# EAGLE design NewPulse (EAGLE 6.2)
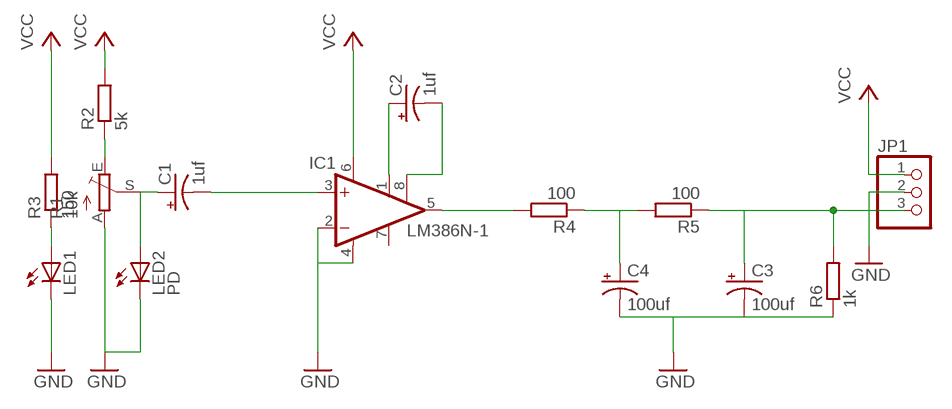
[diagram p0: schematic, sheet 1]

## Parts
C1  1uf  CPOL-USE2-5  [E2-5]
C2  1uf  CPOL-USE2-5  [E2-5]
C3  100uf  CPOL-USE2-5  [E2-5]
C4  100uf  CPOL-USE2-5  [E2-5]
IC1  LM386N-1  [DIL08]
JP1  PINHD-1X3/90  [1X03/90]
LED1  LED5MM  [LED5MM]
LED2  PD  LED5MM  [LED5MM]
R1  10k  TRIM_EU-CA6V  [CA6V]
R2  5k  R-EU_0207/10  [0207/10]
R3  150  R-EU_0207/10  [0207/10]
R4  100  R-EU_0207/10  [0207/10]
R5  100  R-EU_0207/10  [0207/10]
R6  1k  R-EU_0207/10  [0207/10]

## Nets
GND: C3.- C4.- IC1.2(-IN) IC1.4(GND) JP1.2 LED1.K(C) LED2.K(C) R1.A R6.1
N$1: LED1.A R3.1
N$2: R1.E R2.1
N$3: C1.+ LED2.A R1.S
N$4: C1.- IC1.3(+IN)
N$5: C2.+ IC1.1(GAIN)
N$6: C2.- IC1.8(GAIN)
N$7: IC1.5(OUT) R4.2
N$8: C4.+ R4.1 R5.2
N$9: C3.+ JP1.3 R5.1 R6.2
VCC: IC1.6(VS) JP1.1 R2.2 R3.2
Unconnected: IC1.7(BYPASS)

## Library data of the parts
C1-C4 = resistor:CPOL-US: POLARIZED CAPACITOR, American symbol
IC1 = linear:LM386?-*: Low Voltage Audio Power Amplifier Source: http://cache.national.com/ds/LM/LM386.pdf
JP1 = pinhead:PINHD-1X3: PIN HEADER
LED1 LED2 = adafruit:LED: LED OSRAM: - CHIPLED LG R971, LG N971, LY N971, LG Q971, LY Q971, LO R971, LY R971 LH N974, LH R974 LS Q976, LO Q976, LY Q976 LO Q996 - Hyper CHIPLED LW Q18S LB Q993, LB Q99A, LB R99A - SideLED LS A670, LO A670, LY A670, LG A670, LP A670 LB A673, LV A673, LT A673, LW A673 LH A674 LY A675 LS A676, LA A676, LO A676, LY A676, LW A676 LS A679, LY A679, LG A679 - Hyper Micro SIDELED® LS Y876, LA Y876, LO Y876, LY Y876 LT Y87S - SmartLED LW L88C, LW L88S LB L89C, LB L89S, LG L890 LS L89K, LO L89K, LY L89K LS L896, LA L896, LO L896, LY L896 - TOPLED LS T670, LO T670, LY T670, LG T670, LP T670 LSG T670, LSP T670, LSY T670, LOP T670, LYG T670 LG T671, LOG T671, LSG T671 LB T673, LV T673, LT T673, LW T673 LH T674 LS T676, LA T676, LO T676, LY T676, LB T676, LH T676, LSB T676, LW T676 LB T67C, LV T67C, LT T67C, LS T67K, LO T67K, LY T67K, LW E67C LS E67B, LA E67B, LO E67B, LY E67B, LB E67C, LV E67C, LT E67C LW T67C LS T679, LY T679, LG T679 LS T770, LO T770, LY T770, LG T770, LP T770 LB T773, LV T773, LT T773, LW T773 LH T774 LS E675, LA E675, LY E675, LS T675 LS T776, LA T776, LO T776, LY T776, LB T776 LHGB T686 LT T68C, LB T68C - Hyper Mini TOPLED® LB M676 - Mini TOPLED Santana® LG M470 LS M47K, LO M47K, LY M47K Source: http://www.osram.convergy.de/
R1 = pot:TRIM_EU-: POTENTIOMETER
R2-R6 = resistor:R-EU_: RESISTOR, European symbol

## Board
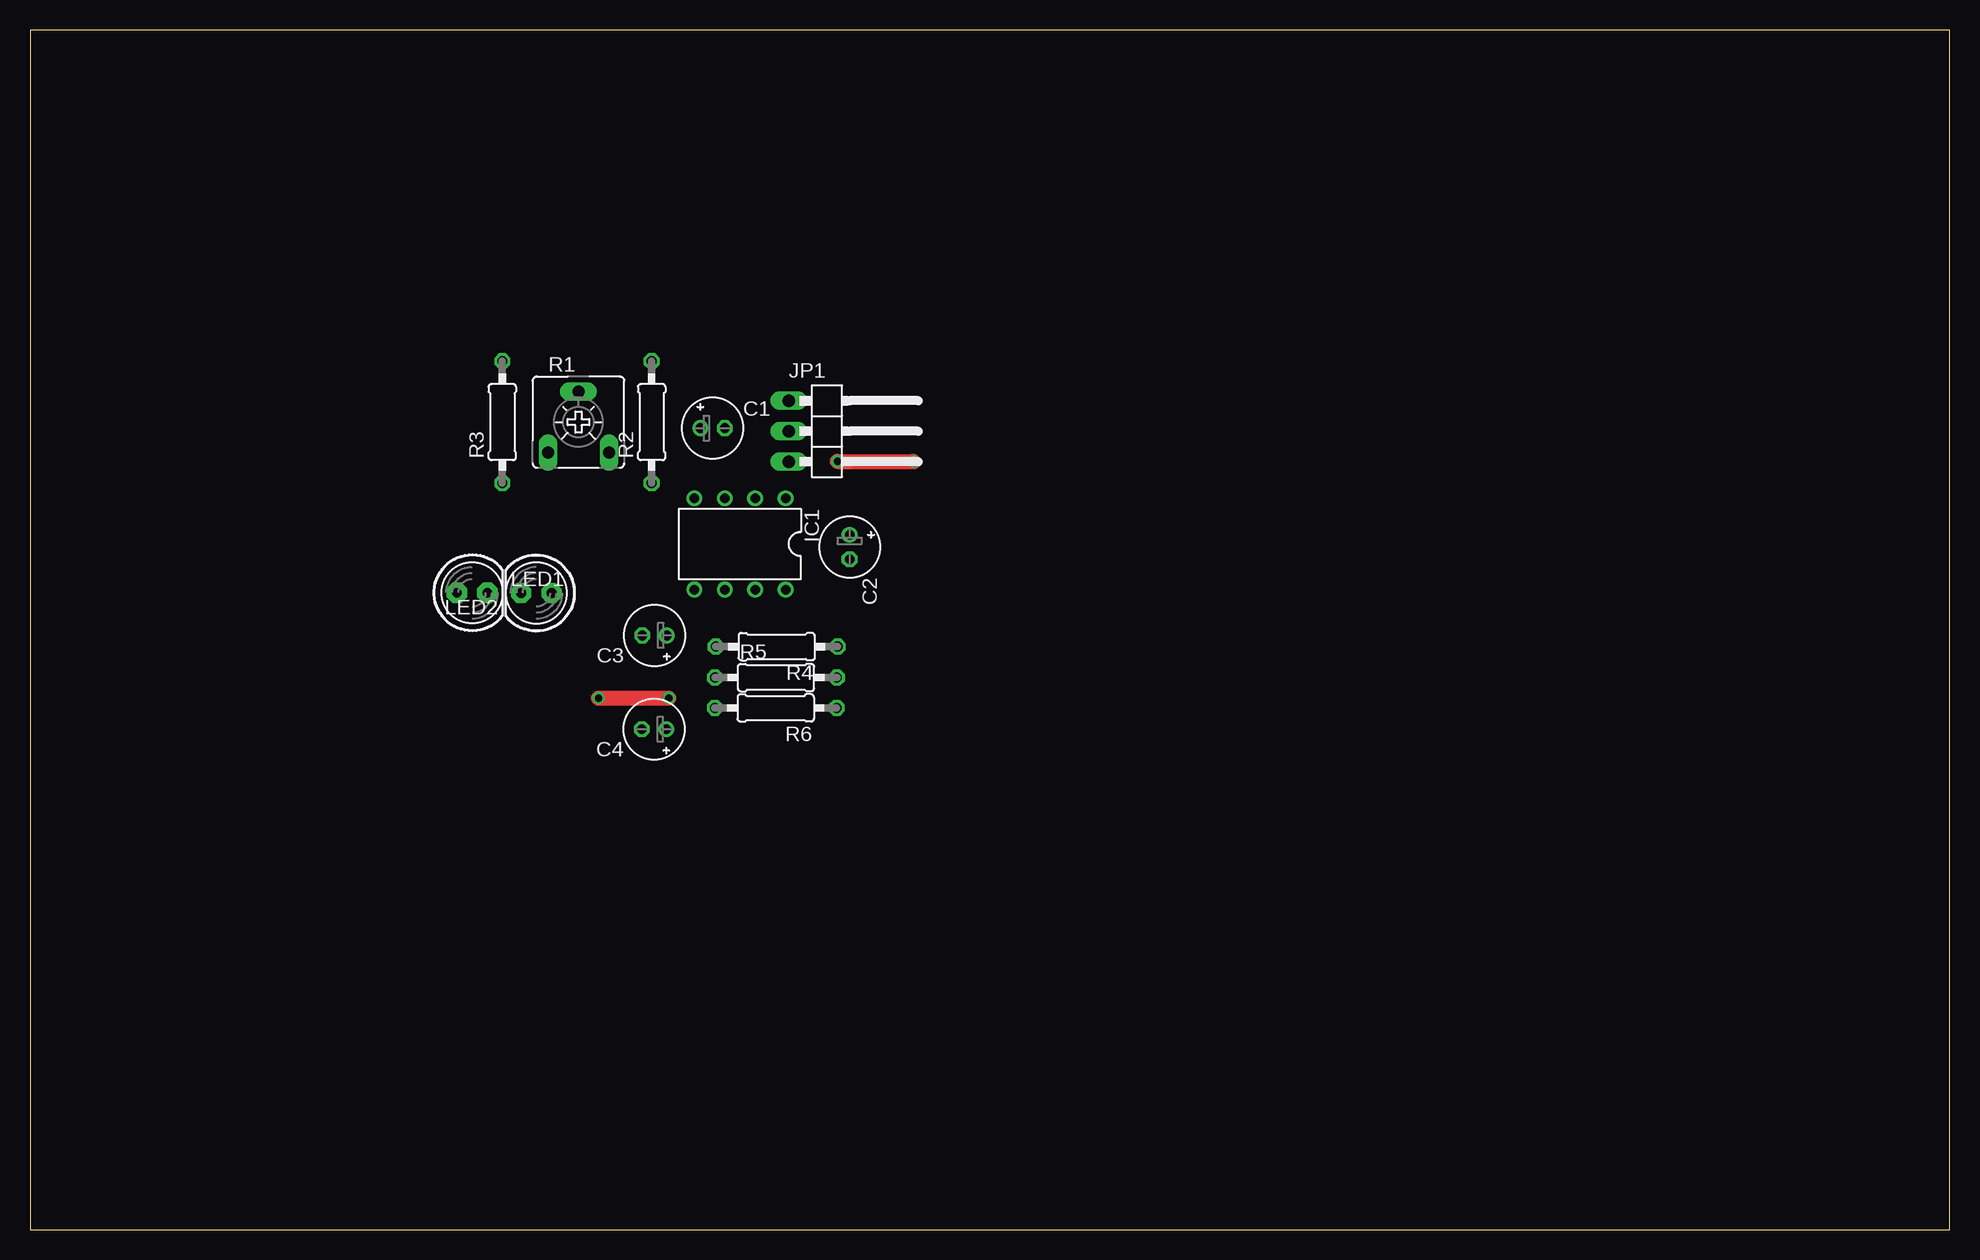
[diagram p1: board, top side]
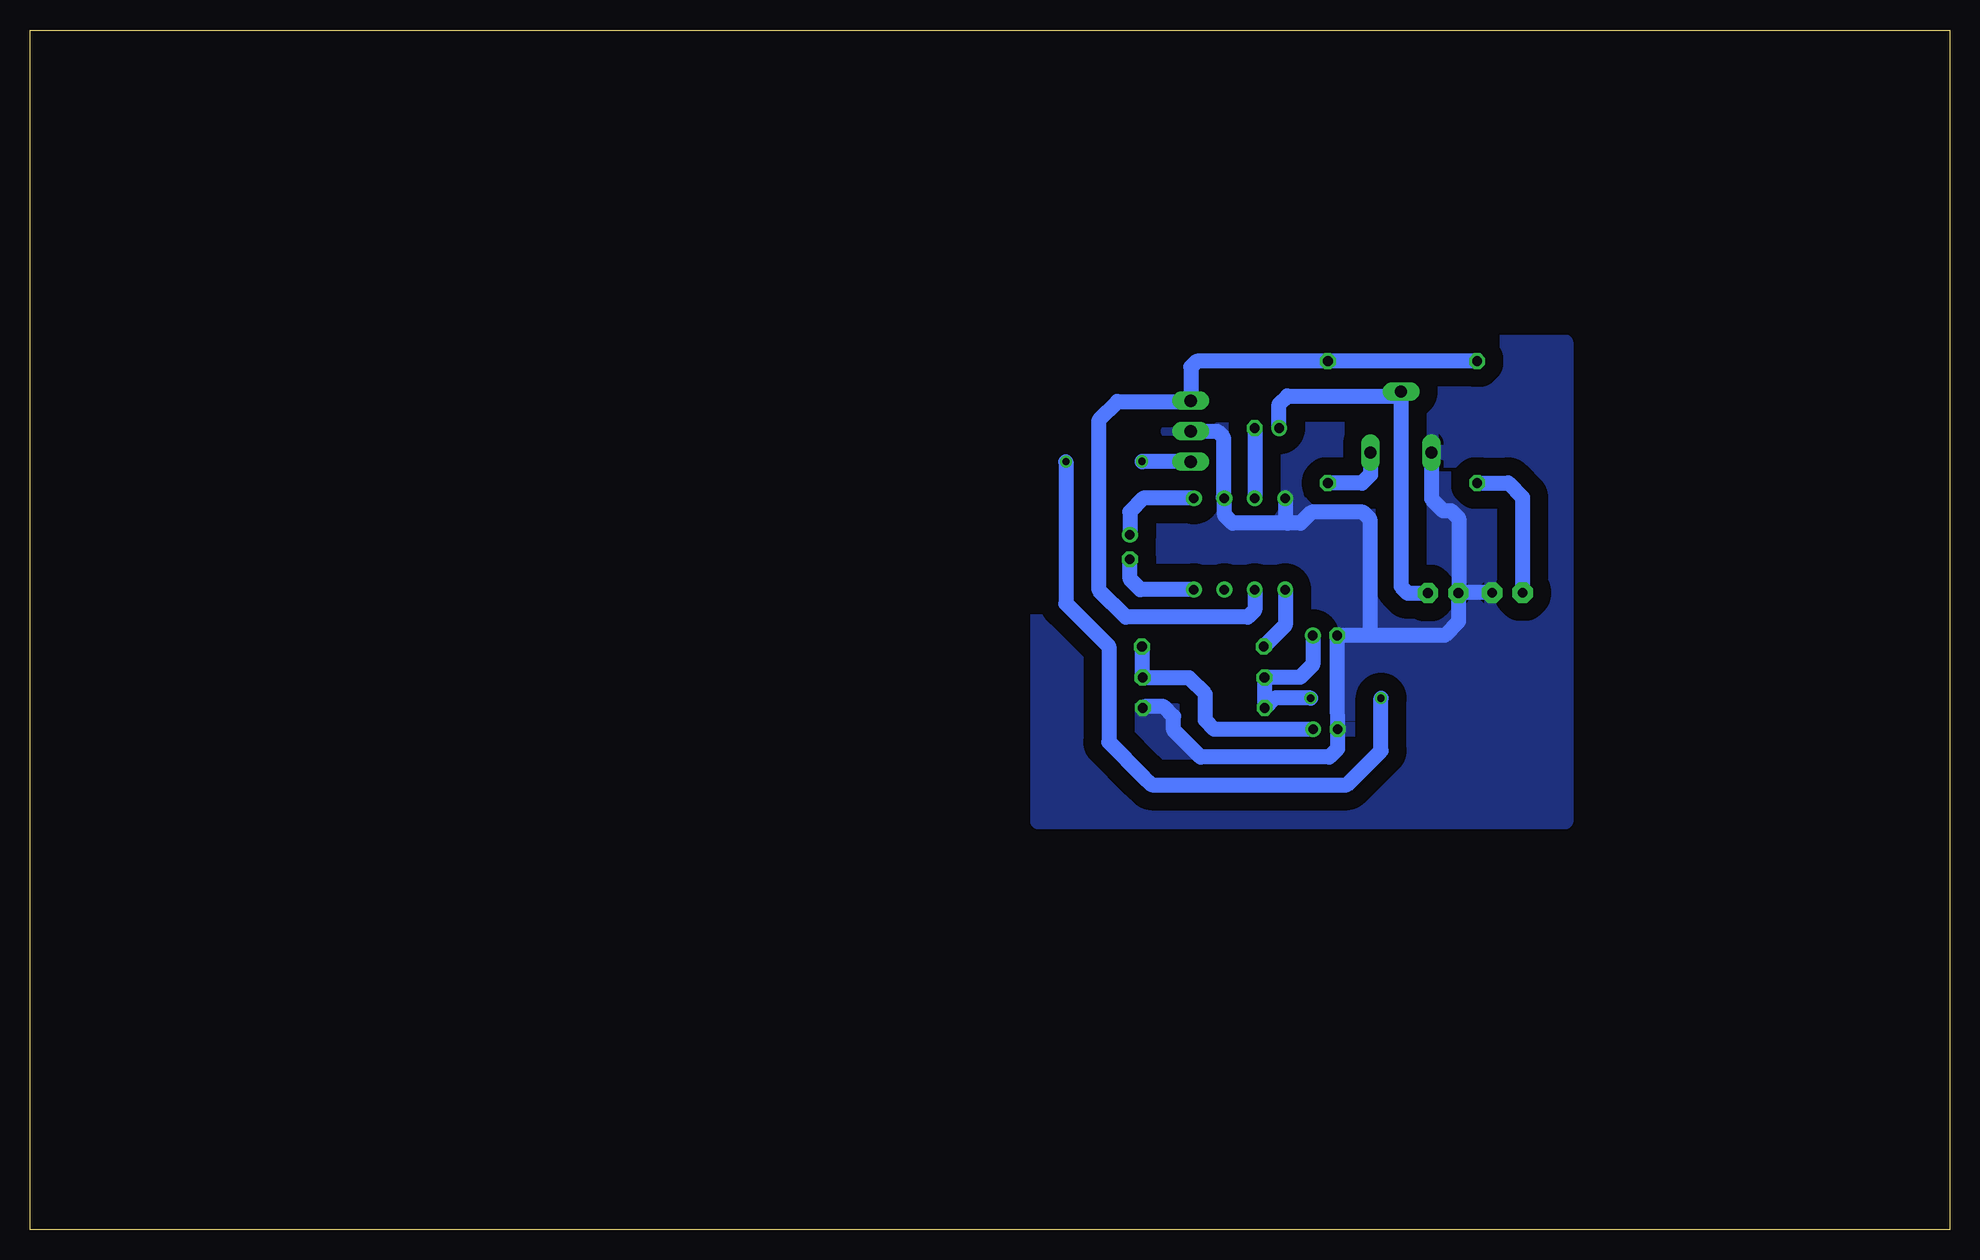
[diagram p2: board, bottom side, seen from below]

Size 160 x 100 mm. Coordinates in mm from the lower left corner, seen from the top.
Outline: 0,0 160,0 160,100 0,100 0,0
Copper layers (1*16): Top 0.035mm / dielectric 1.5mm / Bottom 0.035mm
Design rules: minimum track width 10mil, minimum drill 24mil, track to track 8mil, track to pad 8mil, pad to pad 8mil, via to via 8mil, smd to smd 8mil, copper to edge 40mil, drill to drill 8mil, minimum pad ring 10mil, minimum via ring 8mil, stop-mask expansion 4mil, vias tented up to drill 0mil, thermal gap 10mil

### Footprints (pad centres in the part's own frame; a part is rotated, then mirrored left to right if it is on the bottom)
E2-5 = drill 0.813 pad 1.27: + -1.016,0 | drill 0.813 pad 1.27 octagon: - 1.016,0
DIL08 = drill 0.813 pad 1.27: 1 -3.81,-3.81; 2 -1.27,-3.81; 3 1.27,-3.81; 4 3.81,-3.81; 5 3.81,3.81; 6 1.27,3.81; 7 -1.27,3.81; 8 -3.81,3.81
1X03/90 = drill 1.016 long: 1 -2.54,-3.81; 2 0,-3.81; 3 2.54,-3.81
LED5MM = drill 0.813 pad 1.676 octagon: A -1.27,0; K 1.27,0
CA6V = drill 1.016 long: A -2.54,-2.54; E 2.54,-2.54; S 0,2.54
0207/10 = drill 0.813 octagon: 1 -5.08,0; 2 5.08,0

### Placement (x,y rotation side)
C1  56.9,66.8 0 top
C2  68.33,56.9 270 top
C3  52.06,49.53 180 top
C4  52.02,41.71 180 top
IC1  59.18,57.15 180 top
JP1  67.06,66.55 270 top
LED1  36.86,53.09 0 top
LED2  42.2,53.07 180 top
R1  45.72,67.31 0 top
R2  51.82,67.31 90 top
R3  39.37,67.31 90 top
R4  62.24,48.59 180 top
R5  62.18,46.01 0 top
R6  62.16,43.48 180 top

### Tracks (layer width: path | path; a pad name or v marks a point on that pad's centre or on a via)
GND
  Bottom 1.27: LED1.K 40.91,53.09 | R1.A 43.18,60.9 42.21,59.93 41.55,59.93 40.91,59.29 40.91,53.09 | 40.91,53.09 LED2.K 40.93,50.69 42.08,49.54 48.52,49.54 | 48.52,49.54 48.33,49.73 48.33,59.24 48.89,59.8 53.17,59.8 54.09,58.88 55.18,58.88 | R6.1 67.12,43.6 65.49,43.6 64.67,42.78 64.67,41.64 62.42,39.39 51.69,39.39 51,40.08 C4.- 51.04,44.24 C3.- 48.52,49.54 | JP1.2 61.03,66.55 60.53,66.05 60.53,61.04 IC1.2 60.43,60.94 60.43,59.55 59.76,58.88 55.18,58.88 | IC1.4 55.37,59.07 55.18,58.88
  pour Bottom (isolate 1.5): 32,74 32,36 32,34 76,34 76,74 32,74
N$1
  Bottom 1.27: R3.1 36.78,62.23 35.59,61.04 LED1.A
N$2
  Bottom 1.27: R1.E 48.26,62.92 48.96,62.22 51.81,62.22 R2.1
N$3
  Bottom 1.27: R1.S 45.72,69.35 | 45.72,69.35 45.72,53.61 45.17,53.06 LED2.A | C1.+ 55.88,68.82 55.2,69.5 45.87,69.5 45.72,69.35
N$4
  Bottom 1.27: C1.- IC1.3
N$5
  Bottom 1.27: IC1.1 67.21,60.96 68.32,59.85 C2.+
N$6
  Bottom 1.27: IC1.8 67.44,53.34 68.31,54.21 68.31,55.86 C2.-
N$7
  Bottom 1.27: IC1.5 55.37,50.38 R4.2
N$8
  Bottom 1.27: R4.1 67.32,46.07 R5.2 67.24,45.99 63.39,45.99 62.03,44.63 62.03,42.46 61.28,41.71 C4.+
N$9  (via drill 0.6)
  Top 1.27: v67.31,64.04 73.63,64.04 v73.65,64.02 | v47.39,44.3 v53.25,44.3
  Bottom 1.27: C3.+ 53.08,47.09 54.13,46.04 57.07,46.04 R5.1 57.1,43.5 R6.2 56.26,44.3 v53.25,44.3 | JP1.3 67.28,64.01 v67.31,64.04 | v73.65,64.02 73.65,52.18 70.08,48.61 70.08,40.63 67.24,37.79 67.21,37.79 66.49,37.07 50.23,37.07 48.47,38.83 48.46,38.83 47.39,39.9 v47.39,44.3
VCC
  Bottom 1.27: R3.2 R2.2 62.75,72.39 63.24,71.9 JP1.1 63.29,69.04 69.36,69.04 70.89,67.51 70.89,53.29 68.65,51.05 58.5,51.05 57.91,51.64 IC1.6